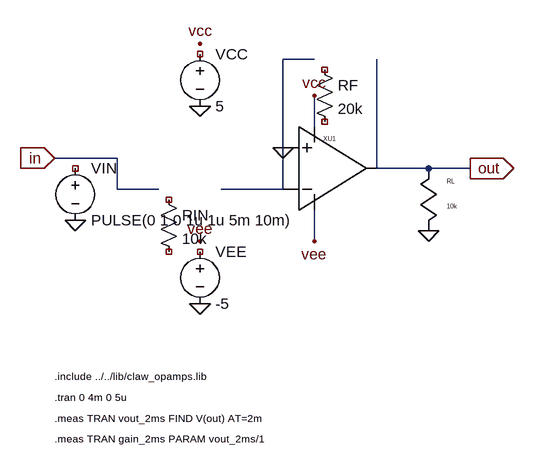
[diagram p0: schematic opamp_inverting.asc]
opamp_inverting.asc, the LTspice schematic file:
Version 4
SHEET 1 1200 839
WIRE 64 224 160 224
WIRE 160 224 160 272
WIRE 160 272 224 272
WIRE 320 272 416 272
WIRE 416 272 416 72
WIRE 416 72 464 72
WIRE 560 72 560 240
WIRE 560 240 704 240
WIRE 464 176 464 128
WIRE 464 304 464 352
SYMBOL voltage 96 224 R0
SYMATTR InstName VIN
SYMATTR Value PULSE(0 1 0 1u 1u 5m 10m)
SYMBOL voltage 288 48 R0
SYMATTR InstName VCC
SYMATTR Value 5
SYMBOL voltage 288 352 R0
SYMATTR InstName VEE
SYMATTR Value -5
SYMBOL res 224 272 R0
SYMATTR InstName RIN
SYMATTR Value 10k
SYMBOL res 464 72 R0
SYMATTR InstName RF
SYMATTR Value 20k
SYMBOL opamp2 416 176 R0
SYMATTR InstName XU1
SYMATTR Value CLAW_IDEAL_OPAMP
SYMBOL res_v 640 240 R0
SYMATTR InstName RL
SYMATTR Value 10k
FLAG 64 224 in
IOPIN 64 224 In
FLAG 704 240 out
IOPIN 704 240 Out
FLAG 96 320 0
FLAG 416 208 0
FLAG 640 336 0
FLAG 288 48 vcc
FLAG 288 144 0
FLAG 288 352 vee
FLAG 288 448 0
FLAG 464 128 vcc
FLAG 464 352 vee
TEXT 64 560 Left 1 !.include ../../lib/claw_opamps.lib
TEXT 64 592 Left 1 !.tran 0 4m 0 5u
TEXT 64 624 Left 1 !.meas TRAN vout_2ms FIND V(out) AT=2m
TEXT 64 656 Left 1 !.meas TRAN gain_2ms PARAM vout_2ms/1

The netlist it stands for:
* opamp_inverting.asc
VIN NC_01 0 PULSE(0 1 0 1u 1u 5m 10m)
VCC NC_02 0 5
VEE NC_03 0 -5
RIN NC_04 NC_05 10k
RF NC_06 NC_07 20k
XXU1 CLAW_IDEAL_OPAMP CLAW_IDEAL_OPAMP
RL out 0 10k
.include ../../lib/claw_opamps.lib
.tran 0 4m 0 5u
.meas TRAN vout_2ms FIND V(out) AT=2m
.meas TRAN gain_2ms PARAM vout_2ms/1
.backanno
.end